# Altium schematic sheet eps_interfaces.SchDoc
size A4
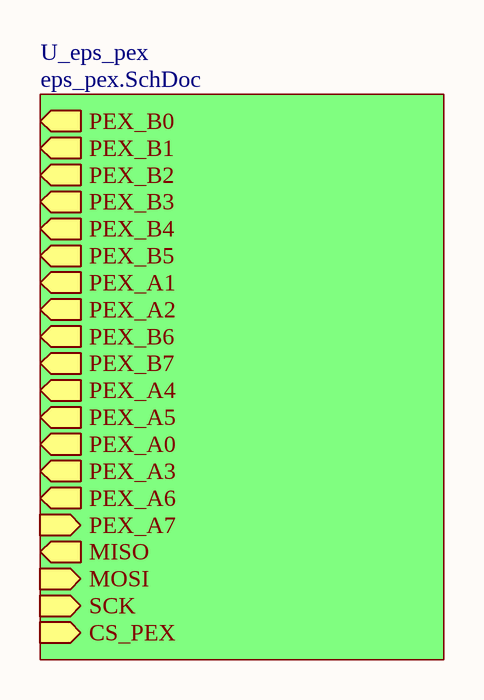
[diagram p0: eps_interfaces.SchDoc]

## Sub-sheets
U_eps_pex = eps_pex.SchDoc: PEX_B0 (out), PEX_B1 (out), PEX_B2 (out), PEX_B3 (out), PEX_B4 (out), PEX_B5 (out), PEX_A1 (out), PEX_A2 (out), PEX_B6 (out), PEX_B7 (out), PEX_A4 (out), PEX_A5 (out), PEX_A0 (out), PEX_A3 (out), PEX_A6 (out), PEX_A7 (in), MISO (out), MOSI (in), SCK (in), CS_PEX (in)